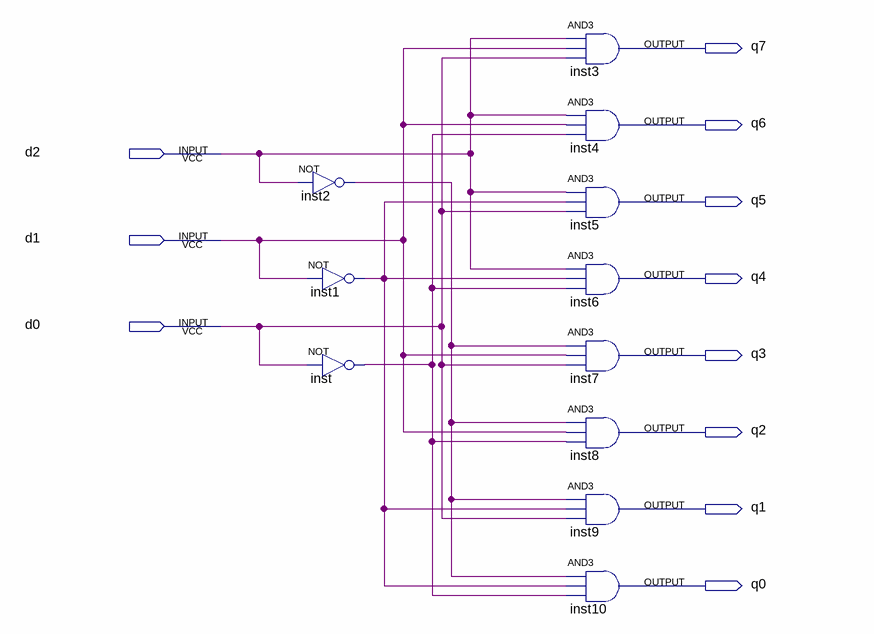
[diagram p0: schematic sheet]
// Quartus schematic 3-8.bdf as structural Verilog: 11 symbols, 11 pins
module \3-8  (
  input  d2,
  input  d1,
  input  d0,
  output q7,
  output q6,
  output q5,
  output q4,
  output q3,
  output q2,
  output q1,
  output q0
);

  wire inst1_out, inst2_out, inst_out;

  not inst2 (inst2_out, d2);
  not inst1 (inst1_out, d1);
  not inst (inst_out, d0);
  and inst3 (q7, d2, d1, d0);
  and inst4 (q6, d2, d1, inst_out);
  and inst5 (q5, d2, inst1_out, d0);
  and inst6 (q4, d2, inst1_out, inst_out);
  and inst7 (q3, inst2_out, d1, d0);
  and inst8 (q2, inst2_out, d1, inst_out);
  and inst9 (q1, inst2_out, inst1_out, d0);
  and inst10 (q0, inst2_out, inst1_out, inst_out);
endmodule
